# EAGLE design communication (EAGLE 6.1)
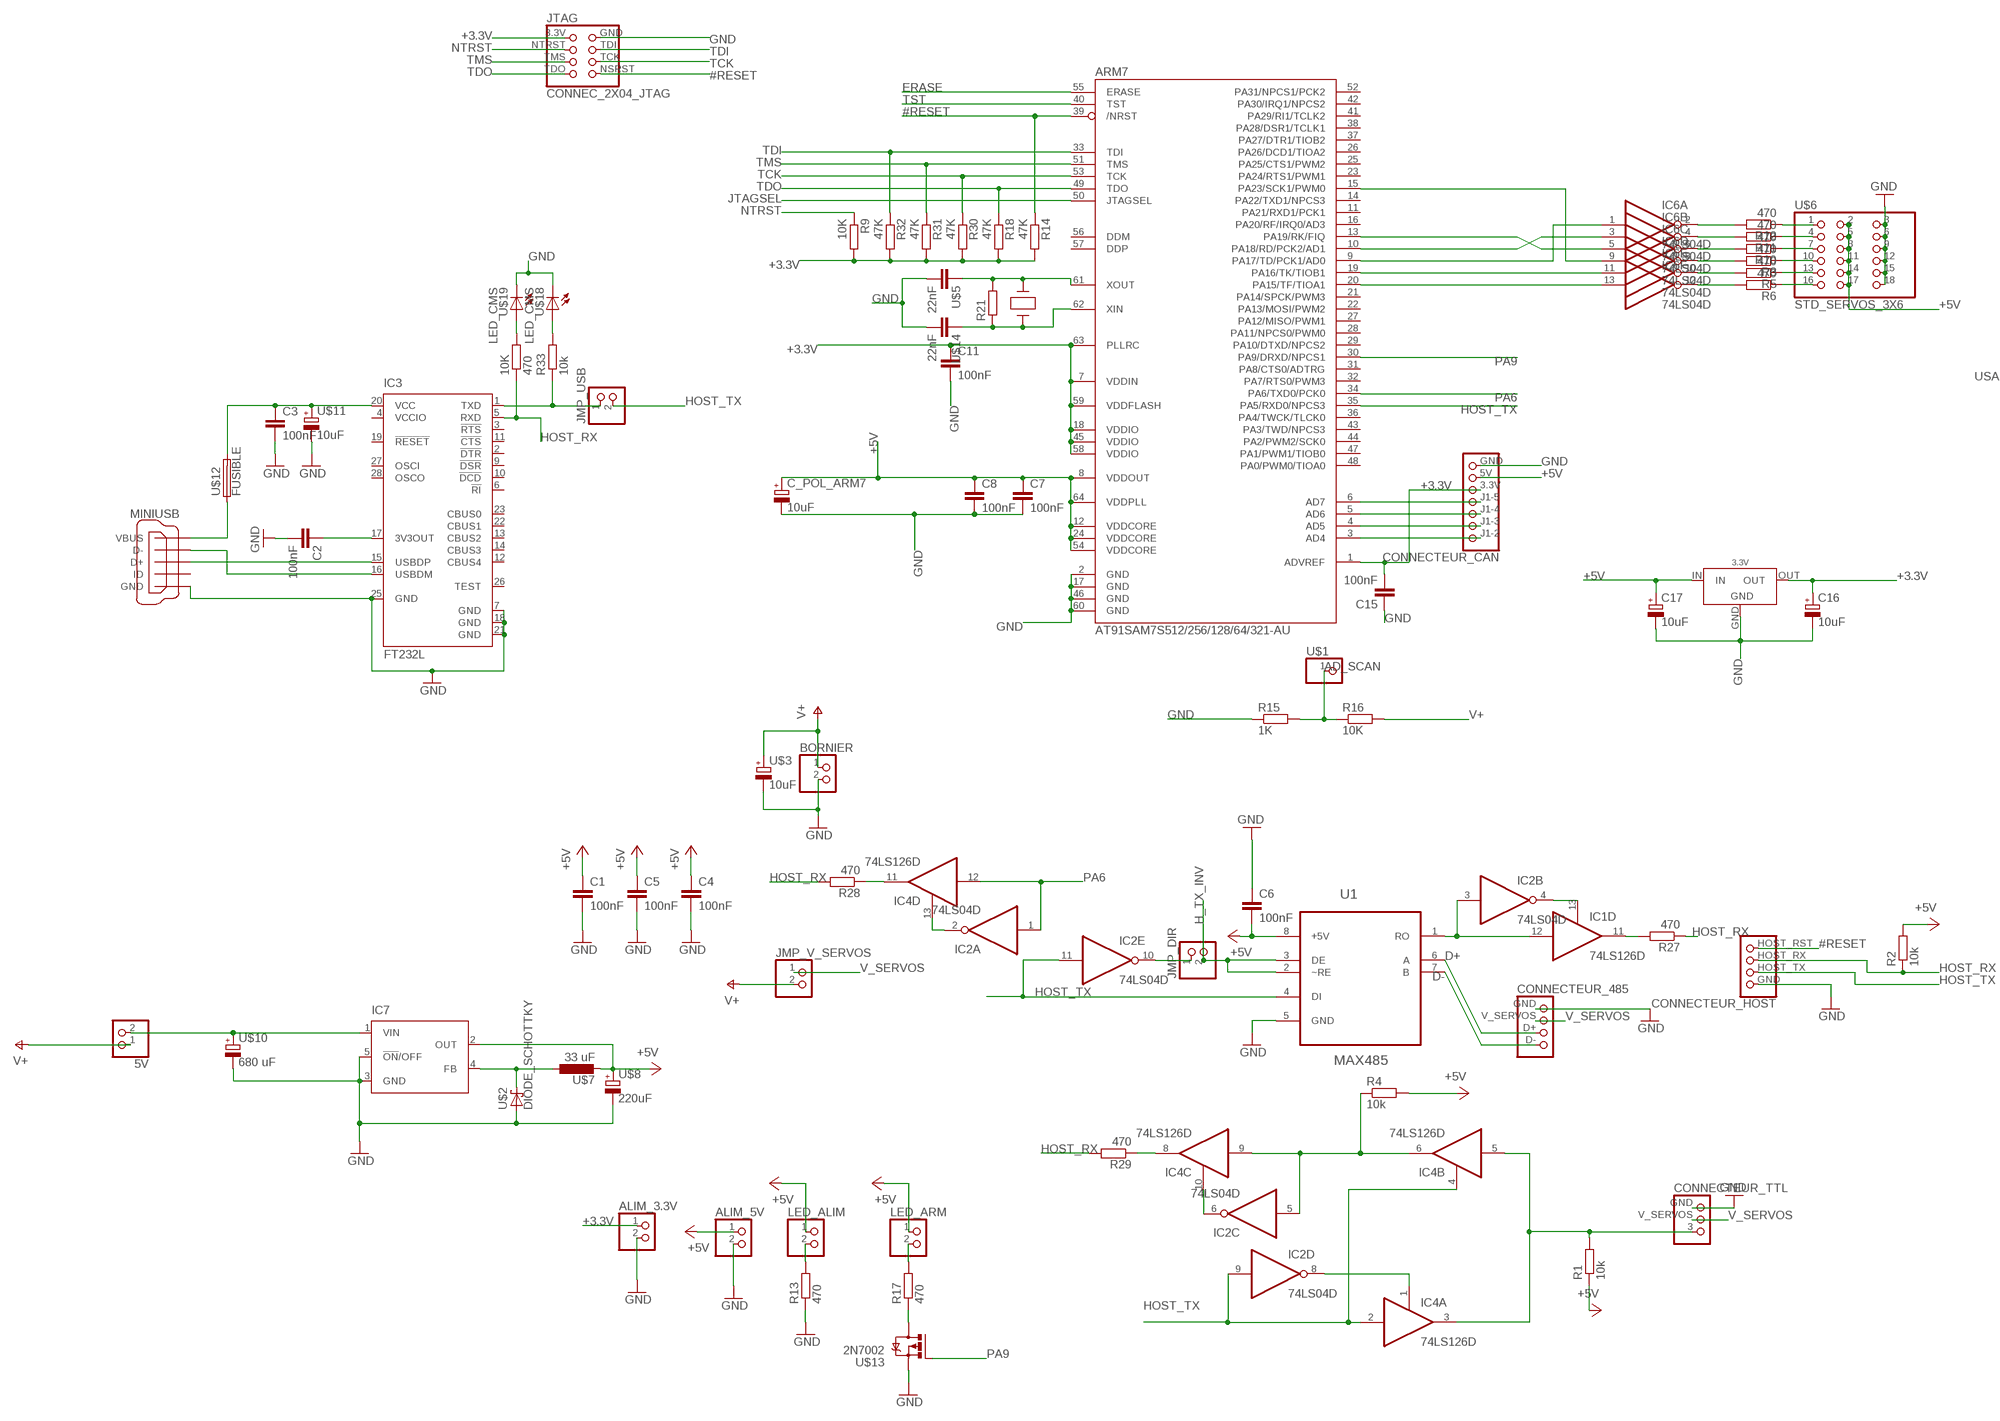
[diagram p0: schematic, sheet 1, part 1 of 2]
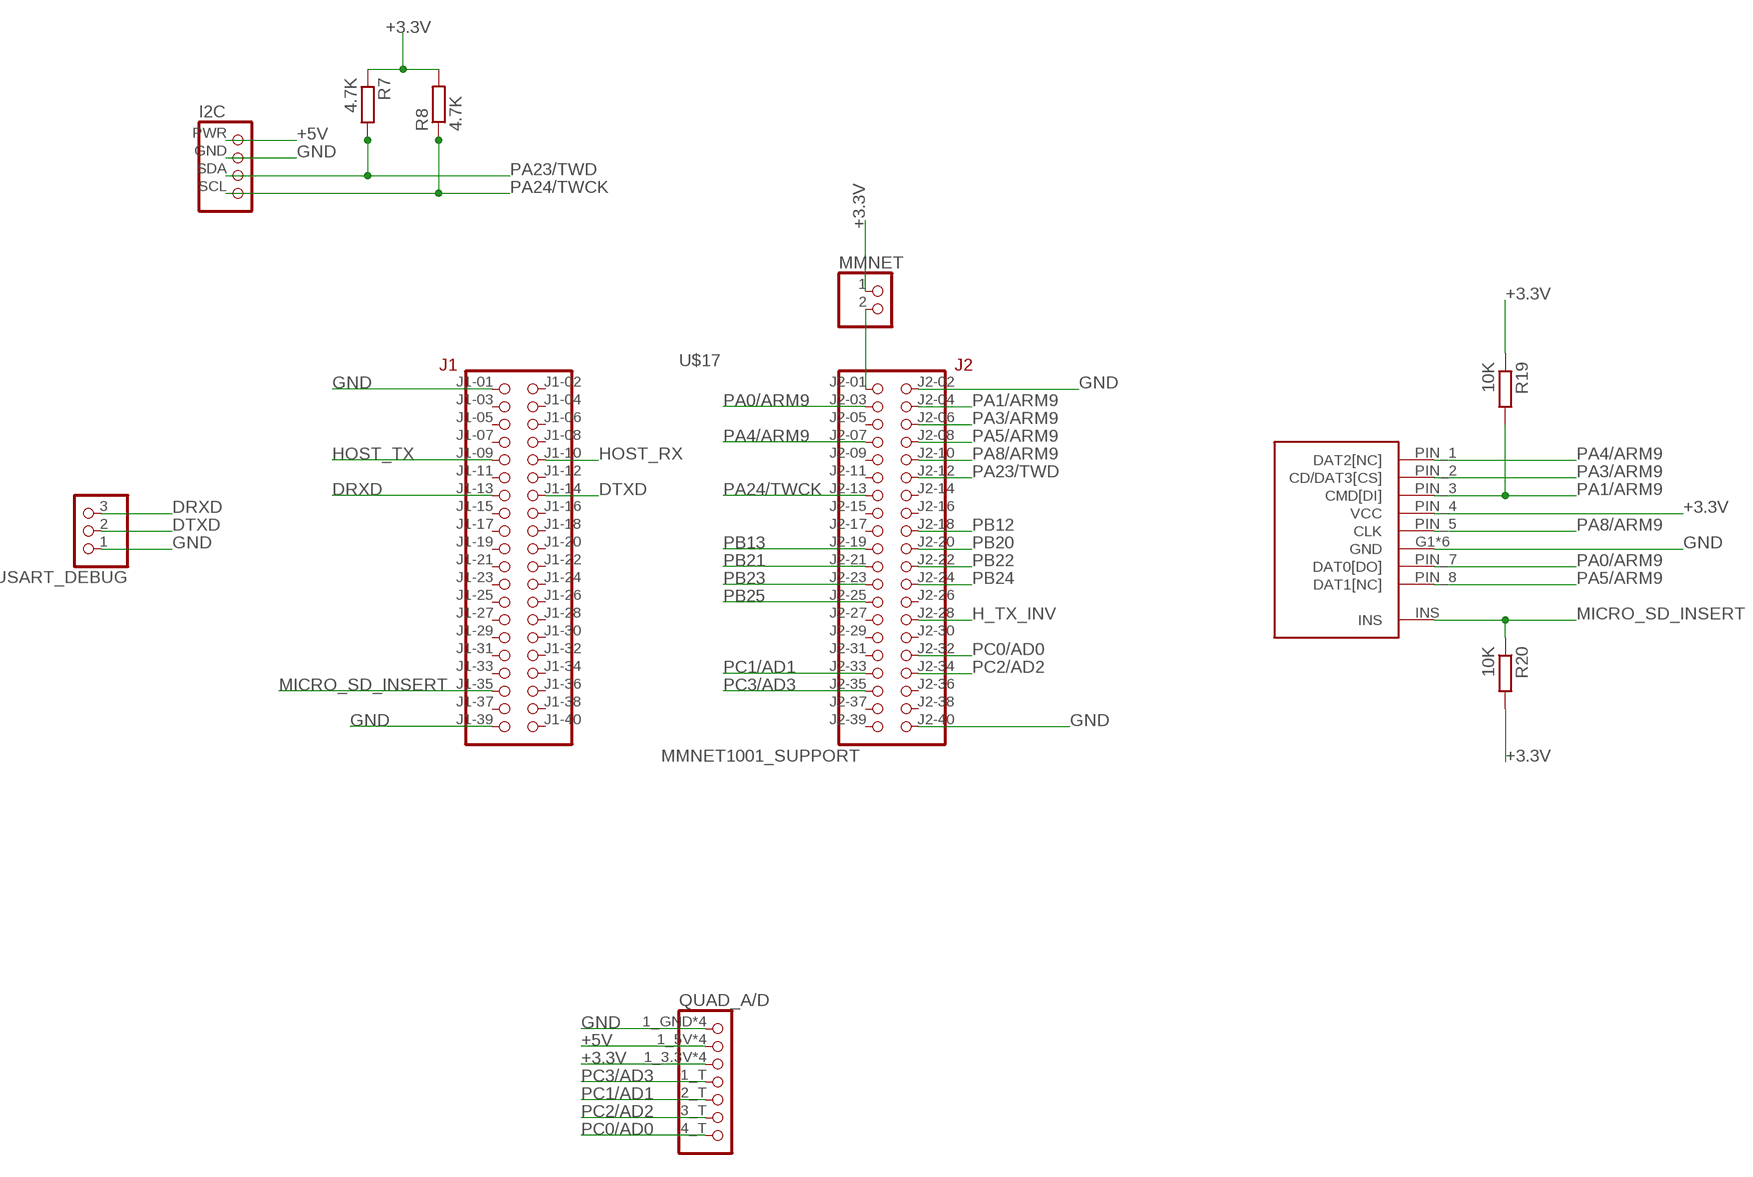
[diagram p1: schematic, sheet 1, part 2 of 2]

## Parts
5V  CONNEC_1X02CONNEC_1X02_LARGE  [CONNEC_ALIM]
10K  470  R-EU_R0805  [R0805@1]
ALIM_3.3V  CONNEC_1X02  [CONNEC_1X02]
ALIM_5V  CONNEC_1X02  [CONNEC_1X02]
ARM7  AT91SAM7S512/256/128/64/321-AU  [LQFP64]
BORNIER  CONNEC_1X02CONNEC_1X02_LARGE  [CONNEC_ALIM]
C1  100nF  C_EU-100NF  [C0805]
C2  100nF  C_EU-100NF  [C0805]
C3  100nF  C_EU-100NF  [C0805]
C4  100nF  C_EU-100NF  [C0805]
C5  100nF  C_EU-100NF  [C0805]
C6  100nF  C_EU-100NF  [C0805]
C7  100nF  C_EU-100NF  [C0805]
C8  100nF  C_EU-100NF  [C0805]
C11  100nF  C_EU-100NF  [C0805]
C15  100nF  C_EU-100NF  [C0805]
C16  10uF  CPOL-EUB  [PANASONIC_B]
C17  10uF  CPOL-EUB  [PANASONIC_B]
C_POL_ARM7  10uF  CPOL-EUB  [PANASONIC_B]
CONNECTEUR_485  CONNECTEUR_485  [CONNECTEUR_485]
CONNECTEUR_CAN  CONNECTOR_CAN  [CONNECTOR_CAN]
CONNECTEUR_HOST  CONNECTEUR_HOST  [CONNECTEUR_HOST]
CONNECTEUR_TTL  CONNECTEUR_TTL  [CONNECTEUR_TTL]
I2C  CONNEC_1X04_I2C  [CONNEC_I2C]
IC1  74LS126D  [SO14]
IC2  74LS04D  [SO14]
IC3  FT232L  [SSOP28]
IC4  74LS126D  [SO14]
IC6  74LS04D  [SO14]
IC7  LM2596S  [TO263-5]
JMP_DIR  CONNEC_1X02  [CONNEC_1X02]
JMP_USB  CONNEC_1X02  [CONNEC_1X02]
JMP_V_SERVOS  CONNEC_1X02CONNEC_1X02_LARGE  [CONNEC_ALIM]
JTAG  CONNEC_2X04_JTAG  [CONNEC_JTAG_MINIMAL]
LED_ALIM  CONNEC_1X02  [CONNEC_1X02]
LED_ARM  CONNEC_1X02  [CONNEC_1X02]
MINIUSB  MINIUSB  [MINI_USB]
MMNET  CONNEC_1X02CONNEC_1X02_LARGE  [CONNEC_ALIM]
QUAD_A/D  QUAD_A/D  [QUAD_A/D]
R1  10k  R-EU_R0805  [R0805@1]
R2  10k  R-EU_R0805  [R0805@1]
R3  470  R-EU_R0805  [R0805@1]
R4  10k  R-EU_R0805  [R0805@1]
R5  470  R-EU_R0805  [R0805@1]
R6  470  R-EU_R0805  [R0805@1]
R7  4.7K  R-EU_R0805  [R0805@1]
R8  4.7K  R-EU_R0805  [R0805@1]
R9  10K  R-EU_R0805  [R0805@1]
R10  470  R-EU_R0805  [R0805@1]
R11  470  R-EU_R0805  [R0805@1]
R12  470  R-EU_R0805  [R0805@1]
R13  470  R-EU_R0805  [R0805@1]
R14  47K  R-EU_R0805  [R0805@1]
R15  1K  R-EU_R0805  [R0805@1]
R16  10K  R-EU_R0805  [R0805@1]
R17  470  R-EU_R0805  [R0805@1]
R18  47K  R-EU_R0805  [R0805@1]
R19  10K  R-EU_R0805  [R0805@1]
R20  10K  R-EU_R0805  [R0805@1]
R21  RESISTANCE-1MOHM  [R0805]
R27  470  R-EU_R0805  [R0805@1]
R28  470  R-EU_R0805  [R0805@1]
R29  470  R-EU_R0805  [R0805@1]
R30  47K  R-EU_R0805  [R0805@1]
R31  47K  R-EU_R0805  [R0805@1]
R32  47K  R-EU_R0805  [R0805@1]
R33  10k  R-EU_R0805  [R0805@1]
U1  MAX485  [SO8]
U$1  CONNEC_1X01  [CONNEC_1X01]
U$2  DIODE_SCHOTTKY  [SOD123W]
U$3  10uF  CPOL-EUB  [PANASONIC_B]
U$4  18.432 Mhz  QUARTZ_18.432  [ABLS]
U$5  22nF  C_EU-22NF  [C0603]
U$6  STD_SERVOS_3X6  [STD_SERVOS_3X6]
U$7  33 uF  L_EU  [SDC0604]
U$8  220uF  CPOL_EU-330UF_25V  [E3,5-8]
U$9  MICRO_SD  [MICRO_SD]
U$10  680 uF  CPOL_EU-680UF_25V  [E3,5-8]
U$11  10uF  CPOL-EUB  [PANASONIC_B]
U$12  FUSIBLE  [FUSIBLE]
U$13  2N7002  [SOT23]
U$14  22nF  C_EU-22NF  [C0603]
U$15  3.3V  REGULATEUR_CMS  [REGULATEUR_CMS]
U$17  MMNET1001_SUPPORT  [MMNET01_SUPPORT]
U$18  LED_CMS  [LED_CMS]
U$19  LED_CMS  [LED_CMS]
USART_DEBUG  CONNEC_1X03  [CONNEC_1X03]

## Nets
#RESET: ARM7.39(/NRST) CONNECTEUR_HOST.HOST_RST JTAG.NSRST R14.1
+3.3V [supply_1A]: ALIM_3.3V.1 ARM7.1(ADVREF) ARM7.7(VDDIN) ARM7.18(VDDIO) ARM7.45(VDDIO) ARM7.58(VDDIO) ARM7.59(VDDFLASH) ARM7.63(PLLRC) C11.1 C15.2 C16.+ CONNECTEUR_CAN.3.3V JTAG.3.3V MMNET.1 QUAD_A/D.1_3.3V QUAD_A/D.2_3.3V QUAD_A/D.3_3.3V QUAD_A/D.4_3.3V R7.1 R8.2 R9.2 R14.2 R18.2 R19.1 R20.2 R30.2 R31.2 R32.2 U$9.PIN_4(VCC) U$15.OUT
+5V [supply_3A]: ALIM_5V.1 ARM7.8(VDDOUT) ARM7.12(VDDCORE) ARM7.24(VDDCORE) ARM7.54(VDDCORE) ARM7.64(VDDPLL) C1.1 C4.1 C5.1 C6.2 C7.1 C8.1 C17.+ C_POL_ARM7.+ CONNECTEUR_CAN.5V I2C.PWR IC7.2(OUT) LED_ALIM.1 LED_ARM.1 QUAD_A/D.1_5V QUAD_A/D.2_5V QUAD_A/D.3_5V QUAD_A/D.4_5V R1.1 R2.2 R4.2 U1.8(+5V) U$6.2 U$6.5 U$6.8 U$6.11 U$6.14 U$6.17 U$7.P$2 U$8.+ U$15.IN
AD_SCAN: R15.2 R16.1 U$1.1
ALIM_USB: C3.1 IC3.20(VCC) U$11.+ U$12.P$2
D+: CONNECTEUR_485.D+ U1.6(A)
D-: CONNECTEUR_485.D- U1.7(B)
DRXD: U$17.J1-13 USART_DEBUG.3
DTXD: U$17.J1-14 USART_DEBUG.2
ERASE: ARM7.55(ERASE)
GND [supply_5A]: ALIM_3.3V.2 ALIM_5V.2 ARM7.2(GND) ARM7.17(GND) ARM7.46(GND) ARM7.60(GND) BORNIER.2 C1.2 C2.2 C3.2 C4.2 C5.2 C6.1 C7.2 C8.2 C11.2 C15.1 C16.- C17.- C_POL_ARM7.- CONNECTEUR_485.GND CONNECTEUR_CAN.GND CONNECTEUR_HOST.GND CONNECTEUR_TTL.GND I2C.GND IC3.7(GND) IC3.18(GND) IC3.21(GND) IC3.25(GND) IC7.3(GND) IC7.5(!ON!/OFF) JTAG.GND MINIUSB.GND QUAD_A/D.1_GND QUAD_A/D.2_GND QUAD_A/D.3_GND QUAD_A/D.4_GND R13.1 R15.1 U1.5(GND) U$2.A U$3.- U$5.2 U$6.3 U$6.6 U$6.9 U$6.12 U$6.15 U$6.18 U$8.- U$9.G1(GND) U$9.G2(GND) U$9.G3(GND) U$9.G5(GND) U$9.G6(GND) U$9.PIN_6(GND) U$10.- U$11.- U$13.2(S) U$14.2 U$15.GND U$17.J1-01 U$17.J1-39 U$17.J2-02 U$17.J2-40 U$18.1(C) U$19.1(C) USART_DEBUG.1
H_TX_INV: JMP_DIR.2 U1.2(~RE) U1.3(DE) U$17.J2-28
HOST_RX: 10K.1 CONNECTEUR_HOST.HOST_RX IC3.5(RXD) R2.1 R27.1 R28.2 R29.2 U$17.J1-10
HOST_TX: ARM7.35(PA5/RXD0/NPCS3) CONNECTEUR_HOST.HOST_TX IC2.9(D:I) IC2.11(E:I) IC4.2(A:I) IC4.4(B:OE) JMP_USB.2 U1.4(DI) U$17.J1-09
J1-2: ARM7.3(AD4) CONNECTEUR_CAN.J1-2
J1-3: ARM7.4(AD5) CONNECTEUR_CAN.J1-3
J1-4: ARM7.5(AD6) CONNECTEUR_CAN.J1-4
J1-5: ARM7.6(AD7) CONNECTEUR_CAN.J1-5
JTAGSEL: ARM7.50(JTAGSEL)
MICRO_SD_INSERT: R20.1 U$9.INS U$17.J1-35
N$1: IC2.6(C:O) IC4.10(C:OE)
N$2: IC2.5(C:I) IC4.6(B:O) IC4.9(C:I) R4.1
N$3: 5V.2 IC7.1(VIN) U$10.+
N$4: IC2.8(D:O) IC4.1(A:OE)
N$5: CONNECTEUR_TTL.3 IC4.3(A:O) IC4.5(B:I) R1.2
N$6: LED_ALIM.2 R13.2
N$7: IC1.12(D:I) IC2.3(B:I) U1.1(RO)
N$8: ARM7.62(XIN) R21.1 U$4.P$2 U$14.1
N$9: R17.1 U$13.3(D)
N$10: LED_ARM.2 R17.2
N$11: IC3.1(TXD) JMP_USB.1 R33.1
N$12: IC1.13(D:OE) IC2.4(B:O)
N$13: R33.2 U$18.2(A)
N$14: MINIUSB.VBUS U$12.P$1
N$15: IC2.2(A:O) IC4.13(D:OE)
N$16: R12.1 U$6.1
N$17: R11.1 U$6.4
N$18: R10.1 U$6.7
N$19: R3.1 U$6.10
N$20: R5.1 U$6.13
N$21: R6.1 U$6.16
N$22: IC6.2(A:O) R12.2
N$23: IC6.4(B:O) R11.2
N$24: IC6.6(C:O) R10.2
N$25: IC6.8(D:O) R3.2
N$26: IC6.10(E:O) R5.2
N$27: IC6.12(F:O) R6.2
N$28: 10K.2 U$19.2(A)
N$29: IC7.4(FB) U$2.C U$7.P$1
N$30: IC2.10(E:O) JMP_DIR.1
N$31: MMNET.2 U$17.J2-01
N$32: ARM7.61(XOUT) R21.2 U$4.P$1 U$5.1
N$44: C2.1 IC3.17(3V3OUT)
N$45: IC3.15(USBDP) MINIUSB.D+
N$46: IC3.16(USBDM) MINIUSB.D-
N$64: ARM7.20(PA15/TF/TIOA1) IC6.13(F:I)
N$65: ARM7.19(PA16/TK/TIOB1) IC6.11(E:I)
N$66: ARM7.15(PA23/SCK1/PWM0) IC6.9(D:I)
N$67: ARM7.13(PA19/RK/FIQ) IC6.5(C:I)
N$68: ARM7.10(PA18/RD/PCK2/AD1) IC6.3(B:I)
N$69: ARM7.9(PA17/TD/PCK1/AD0) IC6.1(A:I)
NTRST: JTAG.NTRST R9.1
PA0/ARM9: U$9.PIN_7(DAT0[DO]) U$17.J2-03
PA1/ARM9: R19.2 U$9.PIN_3(CMD[DI]) U$17.J2-04
PA3/ARM9: U$9.PIN_2(CD/DAT3[CS]) U$17.J2-06
PA4/ARM9: U$9.PIN_1(DAT2[NC]) U$17.J2-07
PA5/ARM9: U$9.PIN_8(DAT1[NC]) U$17.J2-08
PA6: ARM7.34(PA6/TXD0/PCK0) IC2.1(A:I) IC4.12(D:I)
PA8/ARM9: U$9.PIN_5(CLK) U$17.J2-10
PA9: ARM7.30(PA9/DRXD/NPCS1) U$13.1(G)
PA23/TWD: I2C.SDA R7.2 U$17.J2-12
PA24/TWCK: I2C.SCL R8.1 U$17.J2-13
PB12: U$17.J2-18
PB13: U$17.J2-19
PB20: U$17.J2-20
PB21: U$17.J2-21
PB22: U$17.J2-22
PB23: U$17.J2-23
PB24: U$17.J2-24
PB25: U$17.J2-25
PC0/AD0: QUAD_A/D.4_T U$17.J2-32
PC1/AD1: QUAD_A/D.2_T U$17.J2-33
PC2/AD2: QUAD_A/D.3_T U$17.J2-34
PC3/AD3: QUAD_A/D.1_T U$17.J2-35
TCK: ARM7.53(TCK) JTAG.TCK R30.1
TDI: ARM7.33(TDI) JTAG.TDI R32.1
TDO: ARM7.49(TDO) JTAG.TDO R18.1
TMS: ARM7.51(TMS) JTAG.TMS R31.1
TO_RX-1: IC1.11(D:O) R27.2
TO_RX-2: IC4.8(C:O) R29.1
TO_RX-3: IC4.11(D:O) R28.1
TST: ARM7.40(TST)
V+: 5V.1 BORNIER.1 JMP_V_SERVOS.2 R16.2 U$3.+
V_SERVOS [supply_5A]: CONNECTEUR_485.V_SERVOS CONNECTEUR_TTL.V_SERVOS JMP_V_SERVOS.1
Unconnected: ARM7.11(PA21/RXD1/PCK1) ARM7.14(PA22/TXD1/NPCS3) ARM7.16(PA20/RF/IRQ0/AD3) ARM7.21(PA14/SPCK/PWM3) ARM7.22(PA13/MOSI/PWM2) ARM7.23(PA24/RTS1/PWM1) ARM7.25(PA25/CTS1/PWM2) ARM7.26(PA26/DCD1/TIOA2) ARM7.27(PA12/MISO/PWM1) ARM7.28(PA11/NPCS0/PWM0) ARM7.29(PA10/DTXD/NPCS2) ARM7.31(PA8/CTS0/ADTRG) ARM7.32(PA7/RTS0/PWM3) ARM7.36(PA4/TWCK/TLCK0) ARM7.37(PA27/DTR1/TIOB2) ARM7.38(PA28/DSR1/TCLK1) ARM7.41(PA29/RI1/TCLK2) ARM7.42(PA30/IRQ1/NPCS2) ARM7.43(PA3/TWD/NPCS3) ARM7.44(PA2/PWM2/SCK0) ARM7.47(PA1/PWM1/TIOB0) ARM7.48(PA0/PWM0/TIOA0) ARM7.52(PA31/NPCS1/PCK2) ARM7.56(DDM) ARM7.57(DDP) IC1.1(A:OE) IC1.2(A:I) IC1.3(A:O) IC1.4(B:OE) IC1.5(B:I) IC1.6(B:O) IC1.8(C:O) IC1.9(C:I) IC1.10(C:OE) IC2.12(F:O) IC2.13(F:I) IC3.2(!DTR) IC3.3(!RTS) IC3.6(!RI) IC3.9(!DSR) IC3.10(!DCD) IC3.11(!CTS) IC3.12(CBUS4) IC3.13(CBUS2) IC3.14(CBUS3) IC3.19(!RESET) IC3.22(CBUS1) IC3.23(CBUS0) IC3.26(TEST) IC3.27(OSCI) IC3.28(OSCO) MINIUSB.ID U$17.J1-02 U$17.J1-03 U$17.J1-04 U$17.J1-05 U$17.J1-06 U$17.J1-07 U$17.J1-08 U$17.J1-11 U$17.J1-12 U$17.J1-15 U$17.J1-16 U$17.J1-17 U$17.J1-18 U$17.J1-19 U$17.J1-20 U$17.J1-21 U$17.J1-22 U$17.J1-23 U$17.J1-24 U$17.J1-25 U$17.J1-26 U$17.J1-27 U$17.J1-28 U$17.J1-29 U$17.J1-30 U$17.J1-31 U$17.J1-32 U$17.J1-33 U$17.J1-34 U$17.J1-36 U$17.J1-37 U$17.J1-38 U$17.J1-40 U$17.J2-05 U$17.J2-09 U$17.J2-11 U$17.J2-14 U$17.J2-15 U$17.J2-16 U$17.J2-17 U$17.J2-26 U$17.J2-27 U$17.J2-29 U$17.J2-30 U$17.J2-31 U$17.J2-36 U$17.J2-37 U$17.J2-38 U$17.J2-39

## Power pins joined to a net without a drawn wire
+5V: IC1.14(P:+5V) IC2.14(P:+5V) IC4.14(P:+5V) IC6.14(P:+5V)
GND: IC1.7(P:GND) IC2.7(P:GND) IC4.7(P:GND) IC6.7(P:GND) U$15.GND2(GND)
VCCIO: IC3.4(VCCIO)

## Library data of the parts
5V ALIM_3.3V ALIM_5V BORNIER JMP_DIR JMP_USB JMP_V_SERVOS LED_ALIM LED_ARM MMNET = rhoban:CONNEC_1X02
10K R1-R20 R27-R33 = rhoban:R-EU_: RESISTOR, European symbol
ARM7 = at91sam7sxxx-au:AT91SAM7S512/256/128/64/321
C1-C8 C11 C15 = rhoban:C_EU: non polarised condo; DATASHEET: condo100nF.pdf; FARNELL_LINK: http://fr.farnell.com/kemet/c0805c104j5ractu/condensateur-100nf-50v-x7r-0805/dp/1414663RL
C16 C17 C_POL_ARM7 U$3 U$11 = rcl:CPOL-EU: POLARIZED CAPACITOR, European symbol
CONNECTEUR_485 = rhoban:CONNECTEUR_485
CONNECTEUR_CAN = rhoban:CONNECTOR_CAN
CONNECTEUR_HOST = rhoban:CONNECTEUR_HOST
CONNECTEUR_TTL = rhoban:CONNECTEUR_TTL
I2C = rhoban:CONNEC_1X04
IC1 IC4 = rhoban:74*126: Quad bus BUFFER, 3-state
IC2 = rhoban:74*04: Hex INVERTER
IC3 = rhoban:FT232: Source: http://www.ftdichip.com/Documents/DataSheets/DS_FT232R_v104.pdf; DATASHEET: ft232rl.pdf; FARNELL_LINK: http://fr.farnell.com/ftdi/ft232rl/usb-vers-uart-cms-ssop28-232/dp/1146032?Ntt=1146032; MPN: FT232RL; OC_FARNELL: 1146032; OC_NEWARK: 91K9918
IC6 = rhoban:74LS04D: Hex INVERTER
IC7 = rhoban:LM2596: SIMPLE SWITCHER® Power Converter 150 kHz 3A Step-Down Voltage Regulator Source: http://www.national.com/ds/LM/LM2596.pdf; DATASHEET: lm2596.pdf; FARNELL_LINK: http://fr.farnell.com/national-semiconductor/lm2596s-adj/regul-a-decoupage-3a-ajus-cms-2596/dp/9494367?Ntt=9494367; MF: NATIONAL SEMICONDUCTOR; MPN: LM2596S-ADJ/NOPB; OC_FARNELL: 9494367; OC_NEWARK: 41K3842
JTAG = rhoban:CONNEC_2X04
MINIUSB = rhoban:MINIUSB
QUAD_A/D = rhoban:QUAD_A/D
R21 = rhoban:RESISTANCE: RESISTOR, European symbol; DATASHEET: panasonic_resistance.pdf; FARNELL_LINK: http://fr.farnell.com/panasonic/era6aeb105v/resistance-0805-0-1-0-125w/dp/1577699
U1 = rhoban:MAX485; DATASHEET: max485.pdf; DESCRIPTION: ±15kV ESD-Protected, Slew-Rate-Limited, Low-Power, RS-485/RS-422 Transceivers; FARNELL_LINK: http://fr.farnell.com/maxim-integrated-products/max485eesa/transceiver-rs-485-422-cms/dp/1379973?Ntt=1379973; MPN: MAX485EESA+; OC_FARNELL: 1379973; OC_NEWARK: 68K4798; PACKAGE: SOIC-8; SUPPLIER: Maxim
U$1 = rhoban:CONNEC_1X01
U$2 = rhoban:DIODE_SCHOTTKY
U$4 = rhoban:QUARTZ; DATASHEET: quartz.pdf; FARNELL_LINK: http://fr.farnell.com/abracon/abls-18-432mhz-b2-t/crystal-18-432m-18pf-cl-hc49-4hsmx/dp/1611789RL
U$5 U$14 = rhoban:C_EU: non polarised condo; DATASHEET: condo_22pF; FARNELL_LINK: http://fr.farnell.com/multicomp/mcca000258/condensateur-mlcc-0603-np0-100v/dp/1759125
U$6 = rhoban:STD_SERVOS_3X6
U$7 = rhoban:L_EU: Bobine : http://fr.farnell.com/multicomp/mcsdc0604-3r3mu/inductors-3-3uh-20-smd/dp/1864163
U$8 = rhoban:CPOL_EU: 680 uF 16 V : http://fr.farnell.com/panasonic/eeufr1c681l/condensateur-radial-16v-680uf/dp/1800635 680 uF 25 V : http://fr.farnell.com/panasonic/eeufr1e681l/capacitor-radial-25v-680uf-20/dp/2063069 330 uF 25 V : http://fr.farnell.com/panasonic/eeufr1e331/condensateur-radial-25v-330uf/dp/1800648?Ntt=eeufr1e331; DATASHEET: panasonic_aec.pdf; FARNELL_LINK: http://fr.farnell.com/panasonic/eeufr1e331/condensateur-radial-25v-330uf/dp/1800648?Ntt=eeufr1e331
U$9 = rhoban:MICRO_SD: ST2S008V1AR1500 http://www.farnell.com/datasheets/359830.pdf http://www.farnell.com/cad/359831.pdf
U$10 = rhoban:CPOL_EU: 680 uF 16 V : http://fr.farnell.com/panasonic/eeufr1c681l/condensateur-radial-16v-680uf/dp/1800635 680 uF 25 V : http://fr.farnell.com/panasonic/eeufr1e681l/capacitor-radial-25v-680uf-20/dp/2063069 330 uF 25 V : http://fr.farnell.com/panasonic/eeufr1e331/condensateur-radial-25v-330uf/dp/1800648?Ntt=eeufr1e331; DATASHEET: panasonic_aec.pdf; FARNELL_LINK: http://fr.farnell.com/panasonic/eeufr1e681l/capacitor-radial-25v-680uf-20/dp/2063069
U$12 = rhoban:FUSIBLE; DATASHEET: fusible.pdf; FARNELL_LINK: http://fr.farnell.com/jsp/search/productdetail.jsp?id=9943625&Ntt=9943625
U$13 = rhoban:2N7002
U$15 = rhoban:REGULATEUR_CMS
U$17 = rhoban:MMNET1001_SUPPORT
U$18 U$19 = rhoban:LED_CMS: http://fr.farnell.com/dialight/5988110107f/led-0805-rouge/dp/1465992RL
USART_DEBUG = rhoban:CONNEC_1X03

## Net classes
0 default: width 0.152 mm
1 supply_5A: width 0.152 mm
2 supply_3A: width 0.152 mm
3 supply_1A: width 0.152 mm

## Board
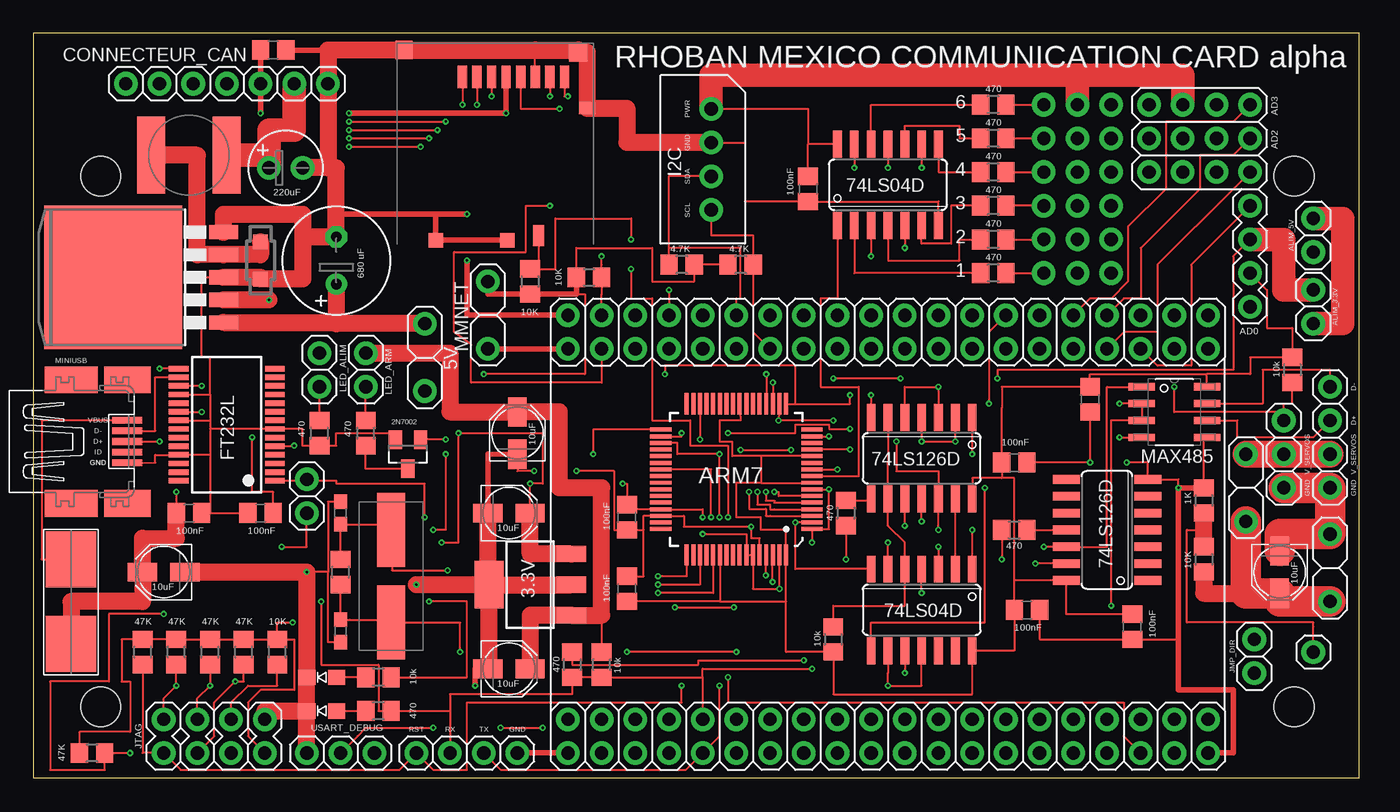
[diagram p2: board, top side]
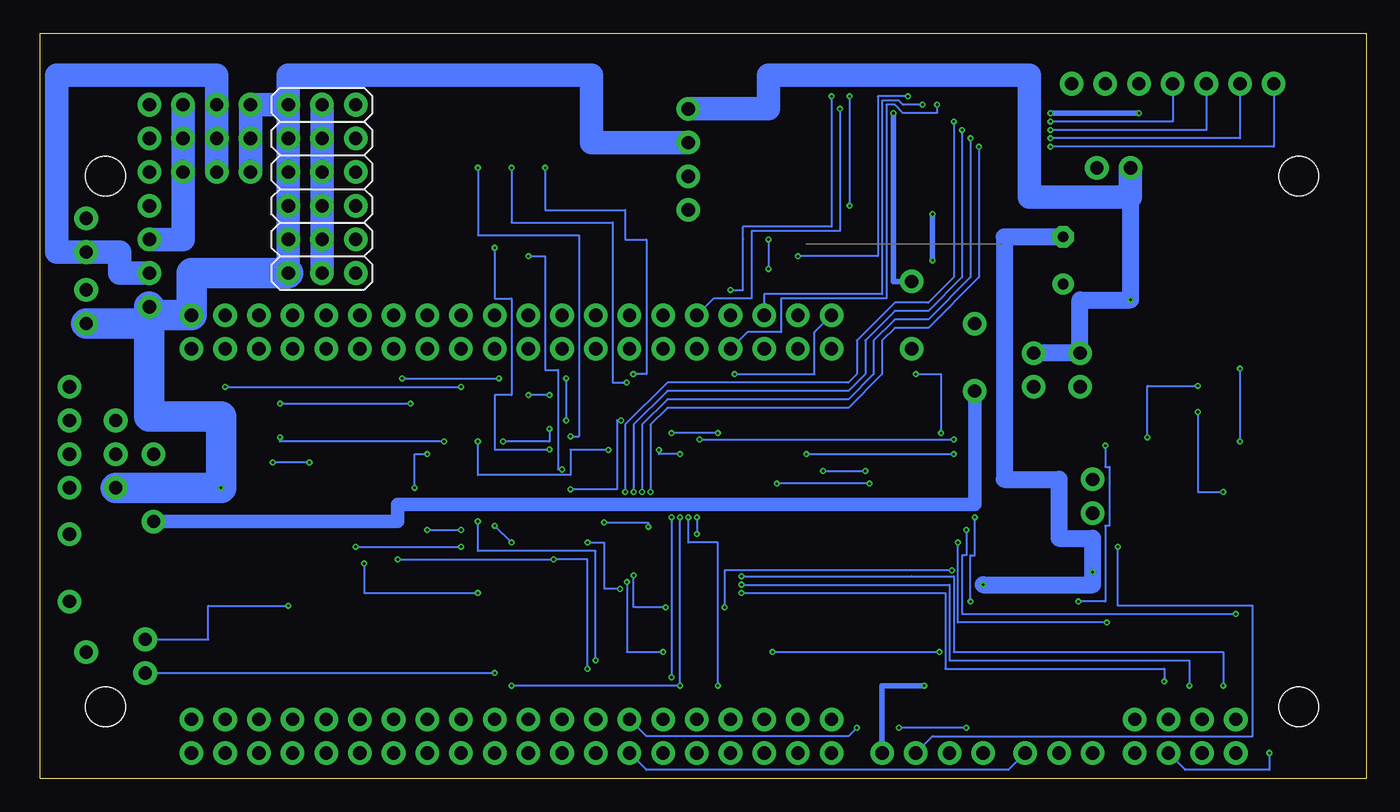
[diagram p3: board, bottom side, seen from below]

Size 100 x 56.2 mm. Coordinates in mm from the lower left corner, seen from the top.
Outline: 100,0 100,56.2 0,56.2 0,0 100,0
Copper layers (1*16): Top 0.035mm / dielectric 1.5mm / Bottom 0.035mm
Design rules: minimum track width 0.125mm, minimum drill 0.2mm, track to track 0.125mm, track to pad 0.125mm, pad to pad 0.125mm, via to via 0.125mm, smd to smd 0.125mm, copper to edge 0.3mm, drill to drill 0.2mm, minimum pad ring 0.2mm, minimum via ring 0.125mm, stop-mask expansion 0.075mm, vias tented up to drill 0mil, thermal gap 0.2mm
Holes 3 mm at 5.08,5.41 95.07,5.41 5.08,45.41 95.07,45.41

### Footprints (pad centres in the part's own frame; a part is rotated, then mirrored left to right if it is on the bottom)
CONNEC_ALIM = drill 1 pad 1.778: 1 -2.54,0; 2 2.54,0
R0805@1 = smd 1.3 x 1.5: 1 -0.95,0; 2 0.95,0
CONNEC_1X02 = drill 1 pad 1.778: 1 -1.27,1.27; 2 1.27,1.27
LQFP64 = smd 0.3 x 1.6: 1 -3.75,-5.7; 2 -3.25,-5.7; 3 -2.75,-5.7; 4 -2.25,-5.7; 5 -1.75,-5.7; 6 -1.25,-5.7; 7 -0.75,-5.7; 8 -0.25,-5.7; 9 0.25,-5.7; 10 0.75,-5.7; 11 1.25,-5.7; 12 1.75,-5.7; 13 2.25,-5.7; 14 2.75,-5.7; 15 3.25,-5.7; 16 3.75,-5.7; 33 3.75,5.7; 34 3.25,5.7; 35 2.75,5.7; 36 2.25,5.7; 37 1.75,5.7; 38 1.25,5.7; 39 0.75,5.7; 40 0.25,5.7; 41 -0.25,5.7; 42 -0.75,5.7; 43 -1.25,5.7; 44 -1.75,5.7; 45 -2.25,5.7; 46 -2.75,5.7; 47 -3.25,5.7; 48 -3.75,5.7 | smd 1.6 x 0.3: 17 5.7,-3.75; 18 5.7,-3.25; 19 5.7,-2.75; 20 5.7,-2.25; 21 5.7,-1.75; 22 5.7,-1.25; 23 5.7,-0.75; 24 5.7,-0.25; 25 5.7,0.25; 26 5.7,0.75; 27 5.7,1.25; 28 5.7,1.75; 29 5.7,2.25; 30 5.7,2.75; 31 5.7,3.25; 32 5.7,3.75; 49 -5.7,3.75; 50 -5.7,3.25; 51 -5.7,2.75; 52 -5.7,2.25; 53 -5.7,1.75; 54 -5.7,1.25; 55 -5.7,0.75; 56 -5.7,0.25; 57 -5.7,-0.25; 58 -5.7,-0.75; 59 -5.7,-1.25; 60 -5.7,-1.75; 61 -5.7,-2.25; 62 -5.7,-2.75; 63 -5.7,-3.25; 64 -5.7,-3.75
C0805 = smd 1.3 x 1.5: 1 -0.95,0; 2 0.95,0
PANASONIC_B = smd 2.2 x 1.4: + 1.6,0; - -1.6,0
CONNECTEUR_485 = drill 1 pad 1.778: D+ 3.81,1.27; D- 6.35,1.27; GND -1.27,1.27; V_SERVOS 1.27,1.27
CONNECTOR_CAN = drill 1 pad 1.778: 3.3V 8.89,1.27; 5V 11.43,1.27; GND 13.97,1.27; J1-2 -1.27,1.27; J1-3 1.27,1.27; J1-4 3.81,1.27; J1-5 6.35,1.27
CONNECTEUR_HOST = drill 1 pad 1.778: GND -1.27,1.27; HOST_RST 6.35,1.27; HOST_RX 3.81,1.27; HOST_TX 1.27,1.27
CONNECTEUR_TTL = drill 1 pad 1.778: 3 3.81,1.27; GND -1.27,1.27; V_SERVOS 1.27,1.27
CONNEC_I2C = drill 1 pad 1.778: GND 5.08,3.81; PWR 2.54,3.81; SCL 10.16,3.81; SDA 7.62,3.81
SO14 = smd 0.66 x 2.032: 1 -3.81,-3.073; 2 -2.54,-3.073; 3 -1.27,-3.073; 4 0,-3.073; 5 1.27,-3.073; 6 2.54,-3.073; 7 3.81,-3.073; 8 3.81,3.073; 9 2.54,3.073; 10 1.27,3.073; 11 0,3.073; 12 -1.27,3.073; 13 -2.54,3.073; 14 -3.81,3.073
SSOP28 = smd 0.4 x 1.5: 1 -4.225,-3.625; 2 -3.575,-3.625; 3 -2.925,-3.625; 4 -2.275,-3.625; 5 -1.625,-3.625; 6 -0.975,-3.625; 7 -0.325,-3.625; 8 0.325,-3.625; 9 0.975,-3.625; 10 1.625,-3.625; 11 2.275,-3.625; 12 2.925,-3.625; 13 3.575,-3.625; 14 4.225,-3.625; 15 4.225,3.625; 16 3.575,3.625; 17 2.925,3.625; 18 2.275,3.625; 19 1.625,3.625; 20 0.975,3.625; 21 0.325,3.625; 22 -0.325,3.625; 23 -0.975,3.625; 24 -1.625,3.625; 25 -2.275,3.625; 26 -2.925,3.625; 27 -3.575,3.625; 28 -4.225,3.625
TO263-5 = smd 1.067 x 2.159: 1 -3.404,-5.791; 2 -1.702,-5.791; 3 0,-5.791; 4 1.702,-5.791; 5 3.404,-5.791 | smd 10.8 x 10.41: 6 0,2.54
CONNEC_JTAG_MINIMAL = drill 1 pad 1.778: 3.3V -3.81,1.27; GND -3.81,-1.27; NSRST 3.81,1.27; NTRST -1.27,-1.27; TCK 1.27,1.27; TDI -1.27,1.27; TDO 3.81,-1.27; TMS 1.27,-1.27
MINI_USB = smd 2.25 x 0.5: D+ 4.225,0; D- 4.225,0.8; GND 4.225,-1.6; ID 4.225,-0.8; VBUS 4.225,1.6 | smd 4 x 2: M1 0,-4.671; M5 0,4.671 | smd 3.5 x 2: M3 4.25,4.671; M4 4.25,-4.671
QUAD_A/D = drill 1 pad 1.778: 1_3.3V 6.35,1.27; 1_5V 3.81,1.27; 1_GND 1.27,1.27; 1_T 8.89,1.27; 2_3.3V 11.43,3.81; 2_5V 11.43,6.35; 2_GND 11.43,8.89; 2_T 11.43,1.27; 3_3.3V 13.97,3.81; 3_5V 13.97,6.35; 3_GND 13.97,8.89; 3_T 13.97,1.27; 4_3.3V 16.51,3.81; 4_5V 16.51,6.35; 4_GND 16.51,8.89; 4_T 16.51,1.27
R0805 = smd 1.3 x 1.5: 1 -0.95,0; 2 0.95,0
SOIC127P600X175-8N = smd 1.981 x 0.533: 1 -2.464,1.905; 2 -2.464,0.635; 3 -2.464,-0.635; 4 -2.464,-1.905; 5 2.464,-1.905; 6 2.464,-0.635; 7 2.464,0.635; 8 2.464,1.905
CONNEC_1X01 = drill 1 pad 1.778: 1 0,0
SOD123W = smd 1.1 x 1.1: A 1.4,0; C -1.4,0
ABLS = smd 5.588 x 2.108: P$1 3.48,0; P$2 -3.48,0
C0603 = smd 1.1 x 1: 1 -0.85,0; 2 0.85,0
STD_SERVOS_3X6 = drill 1 pad 1.778: 1 -6.35,-1.27; 2 -6.35,1.27; 3 -6.35,3.81; 4 -3.81,-1.27; 5 -3.81,1.27; 6 -3.81,3.81; 7 -1.27,-1.27; 8 -1.27,1.27; 9 -1.27,3.81; 10 1.27,-1.27; 11 1.27,1.27; 12 1.27,3.81; 13 3.81,-1.27; 14 3.81,1.27; 15 3.81,3.81; 16 6.35,-1.27; 17 6.35,1.27; 18 6.35,3.81
SDC0604 = smd 5.8 x 2.1: P$1 0,-2.85; P$2 0,2.85
E2,5-6 = drill 1 pad 1.778: + -1.27,0; - 1.27,0
MICRO_SD = smd 1.3 x 1.4: G1 7.6,0 | smd 1.1 x 1.1: G2 5.2,14.35; G3 -0.2,14.35 | smd 1.25 x 0.9: G5 -6.225,4.4 | smd 1.4 x 1.4: G6 -5.55,0.2 | smd 0.8 x 1.6: INS -2.55,14 | smd 0.7 x 1.7: PIN_1 3.2,2.05; PIN_2 2.1,2.05; PIN_3 1,2.05; PIN_4 -0.1,2.05; PIN_5 -1.2,2.05; PIN_6 -2.3,2.05; PIN_7 -3.4,2.05; PIN_8 -4.5,2.05
E3,5-8 = drill 0.813 pad 1.6: + -1.778,0 | drill 0.813 pad 1.6 octagon: - 1.778,0
FUSIBLE = smd 4.242 x 3.81: P$1 0,0; P$2 6.375,0
SOT23 = smd 1 x 1.4: 1 -0.95,-1.1; 2 0.95,-1.1; 3 0,1.1
REGULATEUR_CMS = smd 1.219 x 2.235: GND 0,-3.099; IN -2.311,-3.099; OUT 2.311,-3.099 | smd 3.6 x 2.2: GND2 0,3.099
MMNET01_SUPPORT = drill 1 pad 1.778: J1-01 -19.05,-3.81; J1-02 -19.05,-1.27; J1-03 -16.51,-3.81; J1-04 -16.51,-1.27; J1-05 -13.97,-3.81; J1-06 -13.97,-1.27; J1-07 -11.43,-3.81; J1-08 -11.43,-1.27; J1-09 -8.89,-3.81; J1-10 -8.89,-1.27; J1-11 -6.35,-3.81; J1-12 -6.35,-1.27; J1-13 -3.81,-3.81; J1-14 -3.81,-1.27; J1-15 -1.27,-3.81; J1-16 -1.27,-1.27; J1-17 1.27,-3.81; J1-18 1.27,-1.27; J1-19 3.81,-3.81; J1-20 3.81,-1.27; J1-21 6.35,-3.81; J1-22 6.35,-1.27; J1-23 8.89,-3.81; J1-24 8.89,-1.27; J1-25 11.43,-3.81; J1-26 11.43,-1.27; J1-27 13.97,-3.81; J1-28 13.97,-1.27; J1-29 16.51,-3.81; J1-30 16.51,-1.27; J1-31 19.05,-3.81; J1-32 19.05,-1.27; J1-33 21.59,-3.81; J1-34 21.59,-1.27; J1-35 24.13,-3.81; J1-36 24.13,-1.27; J1-37 26.67,-3.81; J1-38 26.67,-1.27; J1-39 29.21,-3.81; J1-40 29.21,-1.27; J2-01 -19.05,26.67; J2-02 -19.05,29.21; J2-03 -16.51,26.67; J2-04 -16.51,29.21; J2-05 -13.97,26.67; J2-06 -13.97,29.21; J2-07 -11.43,26.67; J2-08 -11.43,29.21; J2-09 -8.89,26.67; J2-10 -8.89,29.21; J2-11 -6.35,26.67; J2-12 -6.35,29.21; J2-13 -3.81,26.67; J2-14 -3.81,29.21; J2-15 -1.27,26.67; J2-16 -1.27,29.21; J2-17 1.27,26.67; J2-18 1.27,29.21; J2-19 3.81,26.67; J2-20 3.81,29.21; J2-21 6.35,26.67; J2-22 6.35,29.21; J2-23 8.89,26.67; J2-24 8.89,29.21; J2-25 11.43,26.67; J2-26 11.43,29.21; J2-27 13.97,26.67; J2-28 13.97,29.21; J2-29 16.51,26.67; J2-30 16.51,29.21; J2-31 19.05,26.67; J2-32 19.05,29.21; J2-33 21.59,26.67; J2-34 21.59,29.21; J2-35 24.13,26.67; J2-36 24.13,29.21; J2-37 26.67,26.67; J2-38 26.67,29.21; J2-39 29.21,26.67; J2-40 29.21,29.21
LED_CMS = smd 1.3 x 1.15: 1 0,0; 2 2.25,0
CONNEC_1X03 = drill 1 pad 1.778: 1 -1.27,1.27; 2 1.27,1.27; 3 3.81,1.27

### Placement (x,y rotation side)
5V  29.53,31.76 90 top
10K  26.04,5.09 180 top
ALIM_3.3V  95.25,35.57 270 top
ALIM_5V  97.79,40.97 90 top
ARM7  53.02,22.55 90 top
BORNIER  97.79,15.88 90 top
C1  58.42,44.46 270 top
C2  17.14,20.01 180 top
C3  11.75,20.01 0 top
C4  74.93,12.71 0 top
C5  82.87,11.44 270 top
C6  79.69,28.59 90 top
C7  73.98,23.82 0 top
C8  44.77,14.3 90 top
C11  44.77,19.7 270 top
C15  18.1,54.94 180 top
C16  35.88,20.01 0 top
C17  35.88,8.27 0 top
C_POL_ARM7  36.51,26.05 90 top
CONNECTEUR_485  99.06,23.19 90 top
CONNECTEUR_CAN  8.26,51.13 0 top
CONNECTEUR_HOST  35.24,3.19 180 top
CONNECTEUR_TTL  95.57,23.19 90 top
I2C  47.31,53.03 270 top
IC1  80.96,18.74 90 top
IC2  66.99,12.71 180 top
IC3  14.61,26.68 90 top
IC4  66.99,24.14 180 top
IC6  64.45,44.78 0 top
IC7  8.57,37.79 90 top
JMP_DIR  93.34,9.22 90 top
JMP_USB  19.37,21.28 270 top
JMP_V_SERVOS  91.44,21.92 270 top
JTAG  13.65,3.19 180 top
LED_ALIM  20.32,30.81 270 top
LED_ARM  23.81,30.81 270 top
MINIUSB  2.86,25.41 0 top
MMNET  34.29,34.94 270 top
QUAD_A/D  93.03,34.3 90 top
R1  94.93,30.81 270 top
R2  42.86,8.58 90 top
R3  72.39,45.73 180 top
R4  60.33,10.49 270 top
R5  72.39,48.27 180 top
R6  72.39,50.81 180 top
R7  48.9,38.74 180 top
R8  53.34,38.74 180 top
R9  18.41,9.54 90 top
R10  72.39,43.19 180 top
R11  72.39,40.65 180 top
R12  72.39,38.11 180 top
R13  21.59,26.05 90 top
R14  8.26,9.54 90 top
R15  88.27,20.96 270 top
R16  88.27,16.52 270 top
R17  25.08,26.05 90 top
R18  10.79,9.54 90 top
R19  41.91,37.79 0 top
R20  37.47,37.48 270 top
R21  23.18,15.57 90 top
R27  73.98,18.74 0 top
R28  40.64,8.58 270 top
R29  61.28,20.01 270 top
R30  15.88,9.54 90 top
R31  13.34,9.54 90 top
R32  4.45,1.92 180 top
R33  26.04,7.63 180 top
U1  MAX485  [SOIC127P600X175-8N]  86.04,27.63 0 top
U$1  96.52,9.54 0 top
U$2  17.14,39.06 270 top
U$3  93.98,15.57 270 top
U$4  26.99,15.25 90 top
U$5  23.18,20.01 90 top
U$6  77.47,44.46 90 bottom
U$7  11.75,47 270 top
U$8  220uF  [E2,5-6]  19.05,46.05 0 top
U$9  35.56,54.94 180 top
U$10  22.86,39.06 90 top
U$11  9.84,15.57 180 top
U$12  2.86,16.52 270 top
U$13  28.26,24.46 180 top
U$14  23.18,11.12 270 top
U$15  37.47,14.62 90 top
U$17  59.37,5.72 0 top
U$18  20.64,7.63 0 top
U$19  20.64,5.09 0 top
USART_DEBUG  21.91,0.65 0 top

### Tracks (layer width: path | path; a pad name or v marks a point on that pad's centre or on a via)
#RESET  (via drill 0.2 pad 0.41)
  Top 0.152: v48.9,7 48.9,5.72 32.7,5.72 32.7,0.65 30.16,0.65 CONNECTEUR_HOST.HOST_RST 27.62,0.65 11.11,0.65 JTAG.NSRST 8.26,1.91 R14.1 | v51.12,19.69 51.12,23.3 ARM7.39
  Bottom 0.152: v48.9,7 48.9,13.35 48.9,17.79 51.12,17.79 v51.12,19.69
+3.3V  (via drill 0.2 pad 0.41)
  Top 0.152: R9.2 R30.2 R31.2 R18.2 R14.2 6.67,10.49 6.67,7.31 7.3,7.31 7.3,3.5 3.49,3.5 R32.2 | C16.+ v37.47,22.23 38.42,22.23 38.42,26.05 v32.07,26.05 32.07,17.79 v30.8,17.79 | R19.1 40.96,39.7 40.96,40.02 46.67,40.02 46.67,37.48 49.84,37.48 R7.1 R8.2 | ARM7.63 v56.27,14.3 54.27,14.3 ARM7.59 ARM7.58 53.77,18.43 v50.48,18.43 | v50.48,19.69 50.48,20.3 ARM7.45 44.77,20.3 C11.1 44.77,22.23 v44.45,22.23 | ARM7.7 v60.01,21.8 60.01,18.8 ARM7.1 v58.72,17.79 | ARM7.18 v56.2,27 v60.33,27 | R9.2 18.41,11.76 v19.56,11.76 | R9.2 19.68,10.49 19.68,6.68 17.14,6.68 16.19,5.72 16.19,3.18 JTAG.3.3V | QUAD_A/D.1_3.3V 90.49,39.38 90.49,30.81 72.71,30.81 v72.71,30.17 | v65.41,30.17 v60.33,30.17 | R20.2 41.59,36.52 41.59,30.49 v33.97,30.49
  Top 0.406: R19.1 40.96,36.52 R20.2 34.29,36.52 MMNET.1 | v17.14,50.17 CONNECTEUR_CAN.3.3V C15.2 | v23.81,50.17 v35.66,50.17 U$9.PIN_4
  Top 1.27: U$15.OUT 37.48,16.93 C16.+
  Top 1.778: ALIM_3.3V.1 94.3,36.84 94.3,40.65 QUAD_A/D.1_3.3V
  Bottom 0.152: v37.47,22.23 v44.45,22.23 | v50.48,19.69 v50.48,18.43 | v56.2,27 56.52,27 56.52,21.8 v60.01,21.8 | v19.56,11.76 30.8,11.76 v30.8,17.79 | v72.71,30.17 v65.41,30.17 | v60.33,30.17 v60.33,27 | v58.72,17.79 57.47,17.79 57.47,14.3 v56.27,14.3 | v33.97,30.49 32.07,30.49 v32.07,26.05
  Bottom 0.406: v17.14,50.17 v23.81,50.17 | v35.66,50.17 35.66,37.48 MMNET.1
  Bottom 1.778: QUAD_A/D.1_3.3V 89.22,40.65 QUAD_A/D.2_3.3V QUAD_A/D.3_3.3V QUAD_A/D.4_3.3V
+5V  (via drill 0.2 pad 0.41)
  Top 0.152: 73.98,14.93 C4.1 73.98,9.64 IC2.14 70.8,6.36 60.33,6.36 R4.2 56.77,9.54 56.77,13.35 | 73.98,14.93 73.98,22.65 73.03,22.65 | 73.03,22.65 70.8,22.65 IC4.14 | 73.03,22.65 C7.1 73.03,27.95 73.03,29.53 C6.2 79.69,30.49 88.51,30.49 | C5.1 77.89,12.39 IC1.14 73.98,14.93 | 56.77,13.35 ARM7.64 56.77,18.74 54.87,18.74 54.87,19.69 53.02,19.69 53.02,22.3 54.87,22.3 | ARM7.54 51.77,13.35 | 51.77,13.35 56.77,13.35 | U1.8 88.51,30.49 | QUAD_A/D.1_5V 93.03,36.84 93.03,33.98 94.93,33.98 R1.1 91.76,31.76 91.76,30.49 88.51,30.49 | 42.86,12.3 R2.2 | 54.87,22.3 ARM7.8 | ARM7.12 54.87,24.3 | 54.87,24.3 54.87,22.3 | 54.87,24.3 52.7,24.3 52.7,25.41 51.75,25.41 51.75,27 53.34,27 ARM7.24 | I2C.PWR 58.42,50.49 58.42,47.85 | IC6.14 58.42,47.85 | C1.1 58.42,47.85 | 51.77,13.35 45.4,13.35 C8.1
  Top 1.27: v17.78,36.09 IC7.2 | C17.+ 37.48,12.3 U$15.IN 42.86,12.3 42.86,21.92 39.69,21.92 39.69,27.64 C_POL_ARM7.+ 31.43,27.64 31.43,32.08 LED_ARM.1
  Top 1.778: U$7.P$2 17.78,47 | 17.78,47 U$8.+ | CONNECTEUR_CAN.5V 19.68,48.91 17.78,48.91 17.78,47 | U$6.17 78.74,53.03 | 78.74,53.03 86.68,53.03 QUAD_A/D.4_5V | 78.74,53.03 51.12,53.03 I2C.PWR
  Bottom 1.27: 17.78,43.83 v17.78,36.09 21.59,36.09 LED_ALIM.1 LED_ARM.1
  Bottom 1.778: QUAD_A/D.1_5V 93.98,38.11 93.98,39.7 ALIM_5V.1 98.74,39.7 98.74,53.03 86.68,53.03 QUAD_A/D.4_5V QUAD_A/D.3_5V QUAD_A/D.2_5V | U$6.17 U$6.14 U$6.11 U$6.8 U$6.5 U$6.2 | I2C.PWR 45.09,50.49 45.09,53.03 25.4,53.03 25.4,43.83 17.78,43.83 U$8.+
AD_SCAN
  Top 0.152: U$1.1 96.52,11.44 96.52,11.76 87,11.76 87,18.74 88.27,18.74
  Top 1.27: R16.1 88.27,18.74 R15.2
ALIM_USB  (via drill 0.2 pad 0.41)
  Top 0.152: IC3.20 11,27.63 v12.7,27.63 | v10.79,21.6 v10.8,21.6 C3.1
  Top 1.27: C3.1 10.79,18.11 8.26,18.11 U$11.+ 8.26,13.35 2.86,13.35 U$12.P$2
  Bottom 0.152: v12.7,27.63 12.7,21.6 v10.79,21.6
D+
  Top 0.152: CONNECTEUR_485.D+ 96.52,25.73 90.81,25.73 90.81,27 U1.6
D-
  Top 0.152: CONNECTEUR_485.D- 97.79,30.81 92.71,30.81 92.71,28.27 U1.7
DRXD
  Bottom 0.152: USART_DEBUG.3 26.99,0.65 54.29,0.65 U$17.J1-13
DTXD  (via drill 0.2 pad 0.41)
  Top 0.152: USART_DEBUG.2 24.45,3.18 25.08,3.82 v30.16,3.82 | v35.24,3.82 v38.42,3.82
  Bottom 0.152: v30.16,3.82 v35.24,3.82 | v38.42,3.82 39.05,3.18 54.29,3.18 U$17.J1-14
GND  (via drill 0.2 pad 0.41)
  Top 0.152: 86.36,10.49 C5.2 75.88,10.49 C4.2 | v86.36,21.92 86.36,22.55 IC1.7 84.04,23.82 v82.45,23.82 | R15.1 88.27,25.73 U1.5 | U$9.PIN_6 37.86,54.94 | MINIUSB.GND 9.21,23.82 9.21,24.41 IC3.25 13.34,24.41 | IC3.18 13.34,28.96 | 13.34,28.96 13.34,27 | 13.34,27 13.34,26.36 | 13.34,26.36 13.34,24.41 | IC3.21 13.34,27 | 13.34,28.96 13.34,31.76 12.7,31.76 12.7,37.79 IC7.3 | IC3.7 | IC3.7 13.34,26.36 | IC3.7 20.32,26.36 20.32,25.09 R13.1 22.86,25.09 22.86,26.05 27.3,26.05 U$13.2 | IC6.7 68.26,43.51 C1.2 53.66,43.51 53.66,47.95 I2C.GND | 13.34,24.41 13.34,20.01 | 13.34,20.01 C2.2 | ARM7.2 v57.47,19.3 57.47,15.78 IC2.7 | v40.96,23.19 43.81,23.19 43.81,18.74 C11.2 46.04,18.75 | v37.78,23.19 36.51,23.19 C_POL_ARM7.- | ARM7.60 54.77,18.11 54.14,18.11 v54.14,18.98 49.06,18.98 49.06,19.8 ARM7.46 46.04,19.8 46.04,18.75 | C6.1 v79.69,23.82 C7.2 | ARM7.17 57.47,28.25 | 57.47,28.25 57.47,31.12 47.62,31.12 v47.62,30.49 | 57.47,28.25 61.59,28.25 v61.59,28.9 | v63.18,28.9 IC4.7 | C3.2 13.34,20.01 | C8.2 46.04,15.25 46.04,18.75 | U$5.2 22.23,20.86 22.23,15.57 | 22.23,15.57 v20.64,15.57 | U$14.2 22.23,10.27 22.23,15.57
  Top 0.406: R15.1 v86.36,21.92 86.36,10.49 86.36,6.68 90.49,6.68 90.49,1.91 U$17.J1-39 | U$17.J1-01 CONNECTEUR_HOST.GND | v33.34,7 33.34,8.27 C17.- | U$9.G3 U$9.G2 30.36,42.55 | 30.36,42.55 22.86,42.55 | U$17.J2-02 32.7,34.94 v32.7,39.06 | v32.7,42.55 30.36,42.55 | C16.- 34.29,24.46 C_POL_ARM7.- | C15.1 22.23,54.94
  Top 1.27: JTAG.GND 17.46,5.09 U$19.1 | USART_DEBUG.1 U$19.1 | U$19.1 U$18.1 v20.64,15.57 U$11.- | R15.1 | 22.23,46.05 CONNECTEUR_CAN.GND 22.23,54.94 U$9.G1 37.86,54.94 41.11,54.94 U$9.G6 41.78,54.74 U$9.G5 44.77,50.54 44.77,47.95 I2C.GND | 22.23,46.05 U$8.- | 22.23,46.05 22.86,46.05 22.86,42.55 U$10.- 20.32,40.84 | 20.32,40.84 20.32,37.66 U$2.A 17.14,37.79 IC7.3 | IC7.5 14.36,42.55 20.32,42.55 20.32,40.84 | C17.- 34.37,8.27 U$15.GND2 | U$15.GND2 U$15.GND | U$15.GND2 34.29,14.61 | 34.29,14.61 C16.- | 34.29,14.61 v28.89,14.61
  Top 1.778: ALIM_3.3V.2 98.74,34.3 98.74,42.24 ALIM_5V.2
  Top 2.286: U$3.- 93.98,18.43 BORNIER.2 CONNECTEUR_485.GND CONNECTEUR_TTL.GND
  Bottom 0.152: v54.14,18.98 54.14,19.3 v57.47,19.3 | v40.96,23.19 v37.78,23.19 | v79.69,23.82 v82.45,23.82 | v47.62,30.49 41.59,30.49 41.59,33.66 U$17.J2-02 | v61.59,28.9 v63.18,28.9
  Bottom 0.406: CONNECTEUR_HOST.GND 36.51,7 v33.34,7 | v32.7,39.06 v32.7,42.55
  Bottom 1.27: U$10.- 27.3,40.84 27.3,22.55 23.18,22.55 23.18,18.11 20.64,18.11 v20.64,15.57 20.64,14.61 v28.89,14.61
  Bottom 1.778: 91.76,34.94 QUAD_A/D.1_GND | U$6.3 U$6.6 U$6.9 U$6.12 U$6.15 U$6.18 | QUAD_A/D.2_GND QUAD_A/D.3_GND QUAD_A/D.4_GND U$6.18 | I2C.GND 58.42,47.95 58.42,53.03 81.28,53.03 U$6.18
  Bottom 2.286: 91.76,34.94 U$17.J2-40 88.58,38.11 U$6.3 | QUAD_A/D.1_GND 91.76,34.3 | 91.76,34.3 ALIM_3.3V.2 | 91.76,34.3 91.76,27.32 86.36,27.32 v86.36,21.92 CONNECTEUR_TTL.GND
H_TX_INV  (via drill 0.2 pad 0.41)
  Top 0.152: U$17.J2-28 72.07,33.66 v72.07,28.27 | v81.92,28.27 U1.2 U1.3 81.28,27 v81.28,13.03
  Bottom 0.152: v81.92,28.27 v72.07,28.27 | JMP_DIR.2 87.31,10.49 87.31,13.03 v81.28,13.03
HOST_RX  (via drill 0.2 pad 0.41)
  Top 0.152: 50.48,7.63 R2.1 R28.2 40.64,6.36 31.43,6.36 31.43,5.09 | 50.48,7.63 U$17.J1-10 | 31.43,5.09 CONNECTEUR_HOST.HOST_RX | 31.43,5.09 10K.1 26.04,5.09 26.04,8.58 21.72,8.58 v21.72,13.35 | IC3.5 19.68,25.05 v19.68,25.09 | 50.48,7.63 50.48,8.27 v58.74,8.27 | R27.1 v73.03,16.52 | R29.2 v61.28,16.52
  Bottom 0.152: v19.68,25.09 19.68,23.5 19.37,23.5 19.37,19.06 19.68,19.06 19.68,13.35 v21.72,13.35 | v58.74,8.27 58.74,16.52 v61.28,16.52 v73.03,16.52
HOST_TX  (via drill 0.2 pad 0.41)
  Top 0.152: IC2.11 66.99,7 v64.45,7 64.45,7.95 IC2.9 | v51.75,7 51.75,3.18 U$17.J1-09 49.21,0.65 35.24,0.65 CONNECTEUR_HOST.HOST_TX | IC4.4 v66.99,25.41 v69.53,25.41 IC4.2 | v81.92,25.73 U1.4 | v51.75,19.69 v51.75,24.46 48.58,24.46 48.58,25.3 ARM7.35 | v18.73,17.47 20.64,17.47 JMP_USB.2 | v53.34,24.78 v57.15,24.78
  Bottom 0.152: v64.45,7 v51.75,7 v51.75,19.69 | v69.53,25.41 81.92,25.41 v81.92,25.73 | CONNECTEUR_HOST.HOST_TX 32.7,3.18 8.57,3.18 8.57,13.03 18.73,13.03 v18.73,17.47 | v51.75,24.46 53.34,24.46 v53.34,24.78 | v57.15,24.78 60.01,24.78 60.01,22.87 66.99,22.87 v66.99,25.41
J1-2  (via drill 0.2 pad 0.41)
  Top 0.152: v23.81,47.63 v29.21,47.63 | v53.98,21.6 53.98,20.96 53.98,20.33 55.24,20.33 55.24,19.8 55.56,19.8 ARM7.3
  Bottom 0.152: CONNECTEUR_CAN.J1-2 6.99,47.63 v23.81,47.63 | v29.21,47.63 29.21,37.79 33.02,33.98 35.56,33.98 36.51,33.03 36.51,30.49 39.05,27.95 52.7,27.95 53.98,26.68 v53.98,21.6
J1-3  (via drill 0.2 pad 0.41)
  Top 0.152: v23.81,48.27 v29.84,48.27 | v54.61,21.6 54.61,20.65 55.56,20.65 55.56,20.3 55.88,20.3 ARM7.4
  Bottom 0.152: CONNECTEUR_CAN.J1-3 9.53,48.27 v23.81,48.27 | v29.84,48.27 29.84,37.79 33.02,34.62 35.56,34.62 37.15,33.03 37.15,30.49 39.05,28.59 52.7,28.59 54.61,26.68 v54.61,21.6
J1-4  (via drill 0.2 pad 0.41)
  Top 0.152: v23.81,48.91 v30.48,48.91 | v55.24,21.6 55.24,20.96 55.88,20.96 55.88,20.8 56.2,20.8 ARM7.5
  Bottom 0.152: CONNECTEUR_CAN.J1-4 12.06,48.91 v23.81,48.91 | v30.48,48.91 30.48,37.79 33.02,35.25 35.56,35.25 37.78,33.03 37.78,30.49 39.05,29.22 52.7,29.22 55.24,26.68 v55.24,21.6
J1-5  (via drill 0.2 pad 0.41)
  Top 0.152: v23.81,49.54 v31.11,49.54 | v55.88,21.6 56.2,21.6 56.2,21.3 ARM7.6
  Bottom 0.152: CONNECTEUR_CAN.J1-5 14.61,49.54 v23.81,49.54 | v31.11,49.54 31.11,37.79 33.02,35.89 35.56,35.89 38.42,33.03 38.42,30.49 39.05,29.85 52.7,29.85 55.88,26.68 v55.88,21.6
MICRO_SD_INSERT  (via drill 0.2 pad 0.41)
  Top 0.152: U$9.INS 38.11,38.43 38.1,38.43 | 38.1,38.43 R20.1 | 38.1,38.43 39.37,38.43 39.37,42.24 45.09,42.24 v45.09,40.65 | v45.09,38.43 45.09,36.2 46.67,36.2 46.67,27.63 46.67,27 49.53,27 49.53,25.09 52.39,25.09 v52.39,19.69 | v52.39,7.63 52.39,5.72 82.23,5.72 82.23,3.18 U$17.J1-35
  Bottom 0.152: v45.09,40.65 v45.09,38.43 | v52.39,19.69 v52.39,7.63
N$1  (via drill 0.2 pad 0.41)
  Top 0.152: IC2.6 v64.45,17.79 | v65.72,19.06 IC4.10
  Bottom 0.152: v64.45,17.79 v65.72,19.06
N$2
  Top 0.152: R4.1 60.33,13.03 65.72,13.03 IC2.5 65.72,17.79 64.45,19.06 IC4.9 64.45,23.82 IC4.6
N$3
  Top 1.27: IC7.1 22.86,34.39 | U$10.+ 22.86,34.39 | 5V.2 22.86,34.3 22.86,34.39
N$4  (via drill 0.2 pad 0.41)
  Top 0.152: IC2.8 63.18,11.76 71.75,11.76 v71.75,21.92 | v70.8,24.46 IC4.1
  Bottom 0.152: v71.75,21.92 71.75,24.46 v70.8,24.46
N$5  (via drill 0.2 pad 0.41)
  Top 0.152: R1.2 94.93,28.27 94.3,28.27 CONNECTEUR_TTL.3 94.3,27.63 86.04,27.63 v86.04,29.54 | IC4.3 v68.26,29.54 65.72,29.54 IC4.5
  Bottom 0.152: v86.04,29.54 v68.26,29.54
N$6
  Top 0.152: R13.2 LED_ALIM.2
N$7  (via drill 0.2 pad 0.41)
  Top 0.152: U1.1 80.96,29.54 80.96,17.47 IC1.12 v76.2,17.47 | v68.26,17.47 IC2.3
  Bottom 0.152: v76.2,17.47 v68.26,17.47
N$8  (via drill 0.2, 0.2 pad 0.41)
  Top 0.152: R21.1 U$14.1 23.88,11.97 26.99,11.97 U$4.P$2 32.19,11.76 v32.19,9.53 | v55.75,14.81 55.75,16.84 ARM7.62 | v53.02,9.53 v44.77,9.53
  Bottom 0.152: v55.75,14.81 55.75,9.53 v53.02,9.53 | v44.77,9.53 v32.19,9.53
N$9
  Top 0.152: U$13.3 25.08,23.36 R17.1
N$10
  Top 0.152: R17.2 LED_ARM.2
N$11  (via drill 0.2 pad 0.41)
  Top 0.152: IC3.1 20.64,22.46 | 20.64,22.46 JMP_USB.1 | 20.64,22.46 22.86,22.46 22.86,22.23 29.53,22.23 v29.53,19.69 | R33.1 32.7,7.63 32.7,13.35 v29.84,13.35
  Bottom 0.152: v29.84,13.35 29.84,16.84 29.53,16.84 v29.53,19.69
N$12  (via drill 0.2 pad 0.41)
  Top 0.152: IC1.13 v75.56,16.2 | v66.99,13.98 IC2.4
  Bottom 0.152: v75.56,16.2 75.56,15.25 75.56,13.98 v66.99,13.98
N$13
  Top 0.152: R33.2 U$18.2
N$14
  Top 0.152: MINIUSB.VBUS 0.64,27.01 0.64,16.52 U$12.P$1
N$15
  Top 0.152: IC2.2 IC4.13
N$16
  Top 0.152: R12.1 U$6.1
N$17
  Top 0.152: R11.1 U$6.4
N$18
  Top 0.152: U$6.7 R10.1
N$19
  Top 0.152: R3.1 U$6.10
N$20
  Top 0.152: R5.1 U$6.13
N$21
  Top 0.152: R6.1 U$6.16
N$22
  Top 0.152: IC6.2 61.91,38.11 R12.2
N$23
  Top 0.152: IC6.4 64.45,39.06 69.85,39.06 69.85,40.65 R11.2
N$24
  Top 0.152: R10.2 69.22,43.19 69.22,40.33 66.99,40.33 IC6.6
N$25
  Top 0.152: IC6.8 68.26,45.73 R3.2
N$26
  Top 0.152: IC6.10 65.72,49.22 69.85,49.22 69.85,48.27 R5.2
N$27
  Top 0.152: IC6.12 63.18,50.81 R6.2
N$28
  Top 0.152: U$19.2 10K.2
N$29
  Top 1.27: U$2.C 17.14,39.49 IC7.4 12.38,39.49 12.38,47 U$7.P$1
N$30  (via drill 0.2 pad 0.41)
  Top 0.152: IC2.10 v65.72,7.95
  Bottom 0.152: JMP_DIR.1 v65.72,7.95
N$31
  Top 0.406: MMNET.2 U$17.J2-01
N$32  (via drill 0.2)
  Top 0.152: R21.2 U$5.1 26.99,19.16 U$4.P$1 27.05,18.62 27.05,15.69 v31.24,15.69 | v55.24,15.31 55.24,16.84 ARM7.61 | v48.39,12.9 v52.83,12.9
  Bottom 0.152: v52.83,12.9 55.24,12.9 v55.24,15.31 | v48.39,12.9 48.39,15.69 v31.24,15.69
N$44  (via drill 0.2 pad 0.41)
  Top 0.152: C2.1 18.1,21.6 16.51,21.6 v16.51,25.73 | v12.7,29.6 IC3.17
  Bottom 0.152: v16.51,25.73 16.51,29.6 v12.7,29.6
N$45  (via drill 0.2 pad 0.41)
  Top 0.152: MINIUSB.D+ v9.53,25.41 | IC3.15 v9.53,30.91
  Bottom 0.152: v9.53,30.91 v9.53,25.41
N$46
  Top 0.152: MINIUSB.D- 9.21,26.21 9.21,30.25 IC3.16
N$64  (via drill 0.2 pad 0.41)
  Top 0.152: IC6.13 v61.91,46.05 | v55.27,30.49 ARM7.20
  Bottom 0.152: v61.91,46.05 61.91,42.87 55.88,42.87 55.88,40.65 54.29,40.65 54.29,30.49 v55.27,30.49
N$65  (via drill 0.2 pad 0.41)
  Top 0.152: IC6.11 v64.45,46.05 | v55.77,29.85 ARM7.19
  Bottom 0.152: v64.45,46.05 64.45,41.92 56.83,41.92 56.83,29.85 v55.77,29.85
N$66  (via drill 0.2 pad 0.41)
  Top 0.152: IC6.9 v66.99,46.05 | ARM7.15 v60.01,25.8
  Bottom 0.152: v66.99,46.05 66.99,40.97 59.37,40.97 59.37,25.8 v60.01,25.8
N$67  (via drill 0.2 pad 0.41)
  Top 0.152: IC6.5 v65.72,40.02 | v61.59,24.8 ARM7.13
  Bottom 0.152: v65.72,40.02 65.72,36.2 64.45,36.2 64.45,28.9 65.72,28.9 65.72,24.8 v61.59,24.8
N$68  (via drill 0.2 pad 0.41)
  Top 0.152: IC6.3 v63.18,39.38 | ARM7.10 v60.64,23.3
  Bottom 0.152: v63.18,39.38 61.91,39.38 61.91,30.81 60.96,30.81 60.96,23.3 v60.64,23.3
N$69
  Top 0.152: IC6.1 60.64,36.2 59.37,36.2 59.37,29.54 62.23,29.54 62.23,22.8 ARM7.9
NTRST
  Top 0.152: JTAG.NTRST 14.92,5.72 16.19,7 18.41,7 18.41,7.95 R9.1
PA0/ARM9  (via drill 0.2 pad 0.41)
  Top 0.152: U$17.J2-03 42.86,31.12 42.86,29.85 33.02,29.85 33.02,32.71 31.75,33.66 31.75,34.94 31.75,39.7 37.15,39.7 37.15,43.19 v38.96,43.19 | U$9.PIN_7 v38.96,51.44
  Bottom 0.152: v38.96,51.44 v38.96,43.19
PA1/ARM9  (via drill 0.2 pad 0.41)
  Top 0.152: U$9.PIN_3 v34.56,51.44 | U$17.J2-04 42.86,36.52 R19.2 42.86,38.74 v42.86,39.38
  Bottom 0.152: v34.56,51.44 36.83,51.44 36.83,39.38 v42.86,39.38
PA3/ARM9  (via drill 0.2 pad 0.41)
  Top 0.152: U$9.PIN_2 v33.46,50.81
  Bottom 0.152: v33.46,50.81 34.92,50.81 35.24,51.13 36.51,51.13 36.51,36.52 45.4,36.52 U$17.J2-06
PA4/ARM9  (via drill 0.2 pad 0.41)
  Top 0.152: U$9.PIN_1 v32.36,50.81
  Bottom 0.152: v32.36,50.81 32.36,50.17 34.92,50.17 35.56,50.81 36.2,50.81 36.2,36.2 44.13,36.2 44.13,33.66 46.67,33.66 U$17.J2-07
PA5/ARM9  (via drill 0.2 pad 0.41)
  Top 0.152: U$9.PIN_8 40.06,51.44 v40.32,51.44 | v47.94,36.84 U$17.J2-08
  Bottom 0.152: v40.32,51.44 40.32,41.6 46.99,41.6 46.99,40.65 46.99,36.84 v47.94,36.84
PA6  (via drill 0.2 pad 0.41)
  Top 0.152: IC2.1 v70.8,18.74 | v68.26,18.74 IC4.12 68.26,23.19 65.09,23.19 v65.09,25.41 | ARM7.34 48.9,25.8 v48.9,26.05 | v52.39,26.05 57.47,26.05 57.47,26.68 60.01,26.68 60.01,26.36 v61.59,26.36
  Bottom 0.152: v70.8,18.74 v68.26,18.74 | v48.9,26.05 v52.39,26.05 | v61.59,26.36 61.59,25.41 v65.09,25.41
PA8/ARM9  (via drill 0.2 pad 0.41)
  Top 0.152: U$9.PIN_5 36.76,50.49 37.78,50.49 v39.69,50.49
  Bottom 0.152: v39.69,50.49 39.69,41.29 46.35,41.29 46.35,36.2 49.21,36.2 U$17.J2-10
PA9  (via drill 0.2 pad 0.41)
  Top 0.152: ARM7.30 v50.27,25.56 | v31.11,25.56 U$13.1
  Bottom 0.152: v50.27,25.56 v31.11,25.56
PA23/TWD
  Top 0.152: I2C.SDA 47.94,45.41 47.94,40.02 | U$17.J2-12 53.02,36.2 53.34,36.2 53.34,40.02 47.94,40.02 | R7.2 47.94,40.02
PA24/TWCK
  Top 0.152: I2C.SCL 51.12,40.97 54.29,40.97 R8.1 54.29,33.66 U$17.J2-13
PC0/AD0
  Top 0.152: QUAD_A/D.4_T 90.49,49.54 85.41,49.54 85.41,44.46 82.55,41.6 82.55,37.48 81.28,36.2 79.69,36.2 U$17.J2-32
PC1/AD1
  Top 0.152: QUAD_A/D.2_T 90.49,44.46 84.77,38.74 84.77,33.66 82.23,33.66 U$17.J2-33
PC2/AD2
  Top 0.152: QUAD_A/D.3_T 90.49,47 87.95,47 87.95,44.46 83.5,40.02 83.5,36.2 82.23,36.2 U$17.J2-34
PC3/AD3
  Top 0.152: QUAD_A/D.1_T 87.31,38.74 87.31,31.12 84.77,31.12 U$17.J2-35
TCK  (via drill 0.2 pad 0.41)
  Top 0.152: JTAG.TCK 13.65,3.18 13.65,5.72 v15.24,7.31 15.88,7.31 R30.1 | ARM7.53 51.27,13.98 v47.12,13.98
  Bottom 0.152: v47.12,13.98 31.75,13.98 31.75,8.27 15.24,8.27 v15.24,7.31
TDI  (via drill 0.2 pad 0.41)
  Top 0.152: R32.1 | R32.1 v7.3,1.91 | ARM7.33 42.23,26.3 v42.23,24.46 | v31.11,24.46 31.11,18.74 v30.16,18.74 | v9.84,12.39 5.71,12.39 5.71,7.31 1.27,7.31 1.27,0.65 5.4,0.65 R32.1
  Bottom 0.152: v7.3,1.91 7.3,0.65 13.65,0.65 JTAG.TDI | v42.23,24.46 v31.11,24.46 | v30.16,18.74 30.16,16.84 30.48,16.84 30.48,12.39 v9.84,12.39
TDO  (via drill 0.2 pad 0.41)
  Top 0.152: JTAG.TDO 9.84,6.04 v10.79,7 R18.1 | ARM7.49 49.27,15.25 v47.12,15.25
  Bottom 0.152: v47.12,15.25 34.29,15.25 31.11,15.25 31.11,9.53 10.79,9.53 v10.79,7
TMS  (via drill 0.2 pad 0.41)
  Top 0.152: JTAG.TMS 12.38,6.04 v13.34,7 R31.1 | ARM7.51 50.27,14.61 v47.12,14.61
  Bottom 0.152: v47.12,14.61 31.43,14.61 31.43,8.9 13.34,8.9 v13.34,7
TO_RX-1
  Top 0.152: R27.2 IC1.11
TO_RX-2
  Top 0.152: R29.1 63.18,20.96 IC4.8
TO_RX-3  (via drill 0.2 pad 0.41)
  Top 0.152: R28.1 40.64,8.58 50.16,8.58 50.16,8.9 v58.1,8.9 | v66.99,19.38 IC4.11
  Bottom 0.152: v58.1,8.9 58.1,17.16 66.99,17.16 v66.99,19.38
V+
  Top 1.27: R16.2 88.27,13.97 91.44,13.97
  Top 2.286: JMP_V_SERVOS.2 91.44,13.97 U$3.+ 93.98,13.35 BORNIER.1
  Bottom 1.016: 5V.1 29.53,20.65 73.03,20.65 73.03,19.38 JMP_V_SERVOS.2
V_SERVOS
  Top 2.032: JMP_V_SERVOS.1 CONNECTEUR_TTL.V_SERVOS CONNECTEUR_485.V_SERVOS

### Text on the board
tNames: RHOBAN MEXICO COMMUNICATION CARD alpha | AD3 | 6 | AD2 | 5 | 4 | 3 | 2 | 1 | AD0